# Altium schematic sheet rs232-rs485-transceiver.SchDoc
size A3; DocumentNumber: 9; SheetNumber: 9; SheetTotal: 45; SheetDescription: RS422/RS485 Transceiver
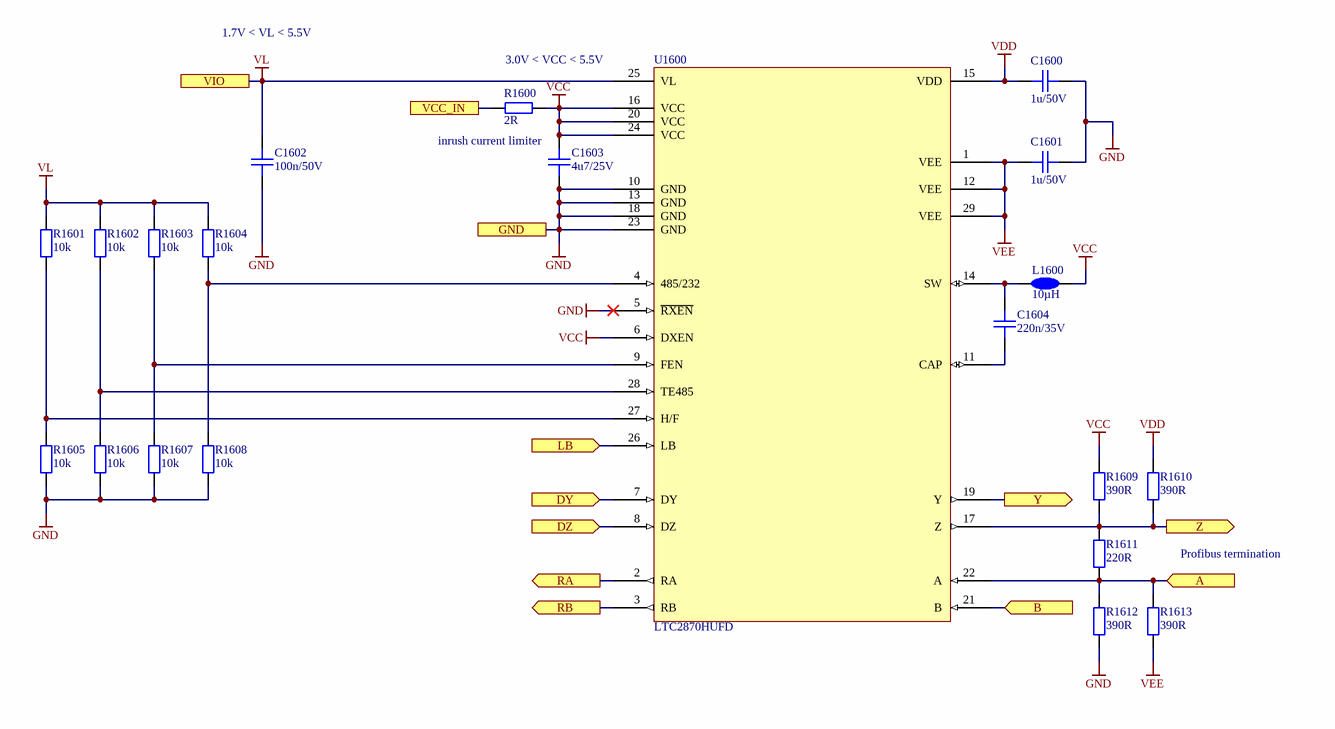
[diagram p0: rs232-rs485-transceiver.SchDoc]

## Parts
C1600  1u/50V  [CAPC1608X08N]
C1601  1u/50V  [CAPC1608X08N]
C1602  100n/50V  [CAPC1005X06N]
C1603  4u7/25V  [CAPC2012X14N]
C1604  220n/35V  [CAPC1005X06N]
L1600  10µH  [INDC2012X14N]
R1600  2R  [RESC2012X05N]
R1601  10k  [RESC1005X04N]
R1602  10k  [RESC1005X04N]
R1603  10k  [RESC1005X04N]
R1604  10k  [RESC1005X04N]
R1605  10k  [RESC1005X04N]
R1606  10k  [RESC1005X04N]
R1607  10k  [RESC1005X04N]
R1608  10k  [RESC1005X04N]
R1609  390R  [RESC1005X04N]
R1610  390R  [RESC1005X04N]
R1611  220R  [RESC1005X04N]
R1612  390R  [RESC1005X04N]
R1613  390R  [RESC1005X04N]
U1600  LTC2870HUFD  [LTC2870-UFD]

## Ports
A (in), B (in), DY (in), DZ (in), GND, LB (in), RA (out), RB (out), VCC_IN, VIO, Y (out), Z (out)

## Nets
GND: C1600.2 C1601.2 C1602.1 C1603.1 R1605.1 R1606.1 R1607.1 R1608.1 R1612.1 U1600.5(~{RXEN}) U1600.10(GND) U1600.13(GND) U1600.18(GND) U1600.23(GND) ; port GND
VCC: C1603.2 L1600.2 R1600.2 R1609.2 U1600.6(DXEN) U1600.16(VCC) U1600.20(VCC) U1600.24(VCC)
VDD: C1600.1 R1610.2 U1600.15(VDD)
VEE: C1601.1 R1613.1 U1600.1(VEE) U1600.12(VEE) U1600.29(VEE)
VL: C1602.2 R1601.2 R1602.2 R1603.2 R1604.2 U1600.25(VL) ; port VIO
A: R1611.1 R1612.2 R1613.2 U1600.22(A) ; port A
B: U1600.21(B) ; port B
DY: U1600.7(DY) ; port DY
DZ: U1600.8(DZ) ; port DZ
LB: U1600.26(LB) ; port LB
RA: U1600.2(RA) ; port RA
RB: U1600.3(RB) ; port RB
VCC_IN: R1600.1 ; port VCC_IN
Y: U1600.19(Y) ; port Y
Z: R1609.1 R1610.1 R1611.2 U1600.17(Z) ; port Z
NetC1604_1: C1604.1 U1600.11(CAP)
NetC1604_2: C1604.2 L1600.1 U1600.14(SW)
NetR1601_1: R1601.1 R1605.2 U1600.27(H/F)
NetR1602_1: R1602.1 R1606.2 U1600.28(TE485)
NetR1603_1: R1603.1 R1607.2 U1600.9(FEN)
NetR1604_1: R1604.1 R1608.2 U1600.4(485/232)

## Notes on the sheet
- 1.7V < VL < 5.5V
- 3.0V < VCC < 5.5V
- (near C1603) inrush current limiter
- Profibus termination
- Fraunhofer IISB
- Schottkystr. 10
- developed by:
- 91058 Erlangen
- Germany
- Author
- Project
- License
- Description
- File
- Version
- Release Date
- Sheet
- foxbms.org <https://foxbms.org>
- www.iisb.fraunhofer.de <https://www.iisb.fraunhofer.de/>
- foxBMS Team
- /

## Library data of the parts
C1600 C1601 = gen_C_ceramic_1u_50V_X7R_0603: MLCC; Capacitance: 1u; Rated Voltage: 50V; Dielectric: X7R; Tolerance: ± 10%; Case EIA: 0603; Case Metric: 1608; Automotive Qualified: False; PnP Package: 0603C; Part Number: gen_C_ceramic_1u_50V_X7R_0603; Operating Temperature: -55°C - +125°C; Supplier 1: Farnell; Supplier Part Number 1: 2779055
C1602 = gen_C_ceramic_100n_50V_X7R_0402: MLCC; Capacitance: 100n; Rated Voltage: 50V; Dielectric: X7R; Case EIA: 0402; Case Metric: 1005; PnP Package: 0402C; PnP Value: 100nF/50V/X7R; PnP equipped: x; Automotive Qualified: True; AEC-Q Norm: AEC-Q200; Part Number: gen_C_ceramic_100n_50V_X7R_0402; Supplier 1: Farnell; Supplier Part Number 1: 2210822; ECCN: EAR99
C1603 = gen_C_ceramic_4u7_25V_X7R_0805: MLCC; Capacitance: 4u7; Rated Voltage: 25V; Dielectric: X7R; Case EIA: 0805; Case Metric: 2012; AVT Set: x; Automotive Qualified: True; AEC-Q Norm: AEC-Q200; Part Number: gen_C_ceramic_4u7_25V_X7R_0805; Supplier 1: Farnell; Supplier Part Number 1: 2346968; ECCN: EAR99
C1604 = gen_C_ceramic_220n_35V_X7R_0402: MLCC; Capacitance: 220n; Rated Voltage: 35V; Dielectric: X7R; Case EIA: 0402; Case Metric: 1005; Automotive Qualified: True; AEC-Q Grade: Grade 1; AEC-Q Norm: AEC-Q200; PnP Package: 0402C; Part Number: gen_C_ceramic_220n_35V_X7R_0402; ECCN: EAR99; Supplier 1: Digikey; Supplier Part Number 1: 445-173767-1-ND
L1600 = LQM21DH100M70L: Power Inductor; Manufacturer: Murata; Rated Current: 300mA; Saturation Current: 250mA; Automotive Qualified: True; Part Number: LQM21DH100M70L; Operating Temperature: -55°C - +150°C; ComponentLink1Description: Datasheet; ComponentLink1URL: https://psearch.en.murata.com/inductor/product/LQM21DH100M70_.pdf; Inductance: 10µH; Supplier 1: Digikey; Supplier Part Number 1: 490-18463-1-ND; Supplier 2: Mouser; Supplier Part Number 2: 81-LQM21DH100M70L
R1600 = gen_R_2R_0805: SMD Resistor 2R 0805; Tolerance: 1%; Power: 0.125W; Case EIA: 0805; Case Metric: 2012; Maximum Working Voltage: 150V; PnP Package: 0805R; Automotive Qualified: True; AEC-Q Grade: Grade 0; AEC-Q Norm: AEC-Q200; Part Number: gen_R_2R_0805; Operating Temperature: -55°C - +155°C; Resistance: 2R; Series: E24, E96; PnP Value: 2R; ECCN: EAR99; Supplier 1: Digikey; Supplier Part Number 1: P19275CT-ND
R1601-R1608 = gen_R_10k_0402: SMD Resistor 10k 0402; Tolerance: 1%; Power: 0.063W; Case EIA: 0402; Case Metric: 1005; Maximum Working Voltage: 50V; PnP Package: 0402R; PnP equipped: x; Automotive Qualified: True; AEC-Q Norm: AEC-Q200; Part Number: gen_R_10k_0402; Operating Temperature: -55°C - +155°C; Resistance: 10k; Series: E24, E96; PnP Value: 10k; Supplier 1: Farnell; Supplier Part Number 1: 2059239; ECCN: EAR99
R1609 R1610 R1612 R1613 = gen_R_390R_0402: SMD Resistor 390R 0402; Tolerance: 1%; Power: 0.063W; Case EIA: 0402; Case Metric: 1005; Maximum Working Voltage: 50V; PnP Package: 0402R; Automotive Qualified: True; AEC-Q Grade: Grade 0; AEC-Q Norm: AEC-Q200; Part Number: gen_R_390R_0402; Operating Temperature: -55°C - +155°C; Resistance: 390R; Series: E24; PnP Value: 390R; ECCN: EAR99; Supplier 1: Farnell; Supplier Part Number 1: 2563565
R1611 = gen_R_220R_0402: SMD Resistor 220R 0402; Tolerance: 1%; Power: 0.063W; Case EIA: 0402; Case Metric: 1005; Maximum Working Voltage: 50V; PnP Package: 0402R; Automotive Qualified: True; AEC-Q Grade: Grade 0; AEC-Q Norm: AEC-Q200; Part Number: gen_R_220R_0402; Operating Temperature: -55°C - +155°C; Resistance: 220R; Series: E24; PnP Value: 220R; ECCN: EAR99; Supplier 1: Digikey; Supplier Part Number 1: A129619CT-ND
U1600 = LTC2870HUFD: RS-232-IC-Interface RS232/RS485 Multiprotocol Transceiver with Integrated Termination; Manufacturer: Analog Devices; PnP Package: QFN-28; Automotive Qualified: False; Part Number: LTC2870HUFD; Part Name: LTC2870HUFD; Operating Temperature: −40°C - +125°C; ComponentLink1Description: Datasheet; ComponentLink1URL: https://www.analog.com/media/en/technical-documentation/data-sheets/28701fb.pdf; Supplier 1: Mouser; Supplier Part Number 1: 584-LTC2870HUFD#PBF; Supplier 2: Digikey; Supplier Part Number 2: LTC2870HUFD#TRPBF-ND